# EasyEDA Pro project ProPrj_CAR BY HAO V1.3(no osd)_2026-07-17.epro, board PCB2
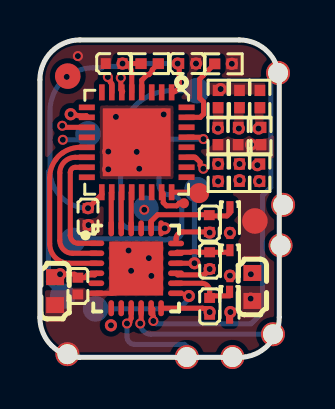
[diagram p4: board, top side]
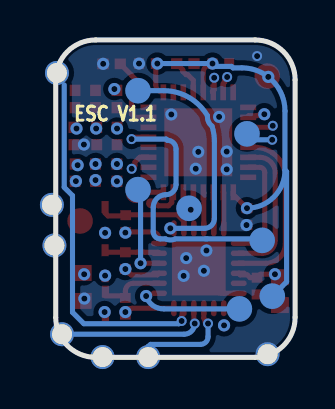
[diagram p5: board, bottom side, seen from below]

Outline 12 x 15.89 mm; copper layers: Top Layer, L2, L3, Bottom Layer. Coordinates in mm from the lower left corner of the outline.
Outline path: 0,13.89 0,2 arc(0.59,0.59) 2,0 10,0 arc(11.41,0.59) 12,2 12,13.89 arc(11.41,15.3) 10,15.89 2,15.89 arc(0.59,15.3) 0,13.89
Stack: Top Layer 0.035mm / Dielectric1 1.51mm FR4 er 4.5 / L2 0.035mm / Dielectric2 0.48mm PP er 4.5 / L3 0.035mm / Dielectric3 0.48mm PP er 4.5 / Bottom Layer 0.035mm

## Design rules (mm)
template: Custom Config
spacing copperThickness1oz (default): track to track 0.152, other pairs 0 to 0.3
spacing copperThickness2oz: track to track 0.203, other pairs 0.152 to 0.3
track width copperThickness1oz (default): min 0.127, default 0.254, max 2.54
track width copperThickness2oz: min 0.203, default 0.254, max 2.54
differential pair differentialPair (default): width min 0.127, default 0.254, max 2.54; gap min 0.152, default 0.152
via viaSize (default): diameter min 0.5, default 0.61, max 10; hole min 0.3, default 0.305, max 6.3
net GND uses phu 100
pour e0 uses phu 100

## Placement (name value [footprint] x y rotation side)
C1  -  [C0603]  0.76 3.32 270 top
C1#2  -  [C0603]  10.65 3.52 270 top
C2  -  [C0402]  1.91 3.57 270 top
C3  1uF  [C0402]  8.49 6.7 270 top
C4  1uF  [C0402]  8.51 4.84 270 top
C5  1uF  [C0402]  8.51 2.55 90 top
C7  100nF  [C0402]  7.41 14.71 0 top
C94  100nF  [C0402]  3.72 14.71 180 top
C123  -  [C0402]  2.41 7.05 90 top
NOREF  -  [Pad_e1078]  7.87 13.35 0 top
NOREF#2  -  [Pad_e1076]  5.32 7.46 0 top
NOREF#3  -  [Pad_e1077]  7.87 8.4 0 top
NOREF#4  -  [Pad_e1071]  11.94 14.24 270 top
NOREF#5  -  [Pad_e1075]  7.98 8.22 0 top
NOREF#6  -  [Pad_e1080]  1.65 5.86 0 top
NOREF#7  -  [Pad_e1073]  12.19 7.63 270 top
NOREF#8  -  [Pad_e1082]  2.79 2.43 0 top
NOREF#9  -  [Pad_e1079]  1.14 3.06 0 top
NOREF#10  -  [Pad_e1069]  9.65 0.01 270 top
NOREF#11  -  [Pad_e10]  10.78 6.83 0 top
NOREF#12  -  [Pad_e1068]  7.37 0.01 270 top
NOREF#13  -  [Pad_e1074]  7.22 7.72 0 top
NOREF#14  -  [Pad_e1081]  2.41 11.19 0 top
NOREF#15  -  [Pad_e1070]  11.68 1.16 270 top
NOREF#16  -  [Pad_e12]  1.4 14.08 0 top
NOREF#17  -  [Pad_e1067]  1.38 0.16 270 top
NOREF#18  -  [Pad_e1072]  12.06 5.6 270 top
R7  10K  [R0402]  11.03 9.25 90 top
R8  10K  [R0402]  10 9.25 90 top
R9  10K  [R0402]  8.93 9.25 90 top
R10  1K  [R0402]  11.09 11.08 90 top
R11  1K  [R0402]  9.94 11.08 90 top
R12  1K  [R0402]  8.93 11.08 90 top
R13  -  [R0402]  5.5 14.7 0 top
R14  -  [R0402]  9.2 14.69 0 top
R54  10K  [R0402]  10 12.93 90 top
R55  10K  [R0402]  8.93 12.93 90 top
R56  10K  [R0402]  11.03 12.93 90 top
U1  FD6288Q  [QFN-24_L4.0-W4.0-P0.50-BL-EP2.7]  4.83 4.46 270 top
U56  AT32F421K8U7  [QFN-32_L5.0-W5.0-P0.50-BL-EP3.4]  4.85 10.77 180 top
U64  1N5819WT  [SOD-523_L1.2-W0.8-LS1.6-RD]  9.53 6.87 270 top
U65  1N5819WT  [SOD-523_L1.2-W0.8-LS1.6-RD]  9.53 4.71 270 top
U66  1N5819WT  [SOD-523_L1.2-W0.8-LS1.6-RD]  9.51 2.64 270 top

## Footprints (pads in the part's own frame, mm; a bottom-side part is the same pattern mirrored in y, then rotated)
C0402
  rect 0.5x0.54 smd: 1(-0.42,0) 2(0.42,0)
C0603
  rect 0.8x0.9 smd: 1(-0.7,0) 2(0.7,0)
Pad_e10
  round 1.282 smd: 1(0,0)
Pad_e12
  round 1.282 smd: 1(0,0)
Pad_e1067
  oval 1.2x1.2 hole 1: 1(0,0)
Pad_e1068
  oval 1.2x1.2 hole 1: 1(0,0)
Pad_e1069
  oval 1.2x1.2 hole 1: 1(0,0)
Pad_e1070
  oval 1.2x1.2 hole 1: 1(0,0)
Pad_e1071
  oval 1.2x1.2 hole 1: 1(0,0)
Pad_e1072
  oval 1.2x1.2 hole 1: 1(0,0)
Pad_e1073
  oval 1.2x1.2 hole 1: 1(0,0)
Pad_e1074
  round 0.5 smd: 1(0,0)
Pad_e1075
  round 1 smd: 1(0,0)
Pad_e1076
  round 1.282 smd far side: 1(0,0)
Pad_e1077
  round 1.282 smd far side: 1(0,0)
Pad_e1078
  round 1.282 smd far side: 1(0,0)
Pad_e1079
  round 1.282 smd far side: 1(0,0)
Pad_e1080
  round 1.282 smd far side: 1(0,0)
Pad_e1081
  round 1.282 smd far side: 1(0,0)
Pad_e1082
  round 1.282 smd far side: 1(0,0)
QFN-24_L4.0-W4.0-P0.50-BL-EP2.7
  oval 0.28x0.8 smd: 1(-1.25,-2) 2(-0.75,-2) 3(-0.25,-2) 4(0.25,-2) 5(0.75,-2) 6(1.25,-2) 13(1.25,2) 14(0.75,2) 15(0.25,2) 16(-0.25,2) 17(-0.75,2) 18(-1.242,2)
  oval 0.8x0.28 smd: 7(2,-1.25) 8(2,-0.75) 9(2,-0.25) 10(2,0.25) 11(2,0.75) 12(2,1.25) 19(-2,1.25) 20(-2,0.75) 21(-2,0.25) 22(-2,-0.25) 23(-2,-0.75) 24(-2,-1.25)
  rect 2.7x2.7 smd: 25(0.013,0)
QFN-32_L5.0-W5.0-P0.50-BL-EP3.4
  rect 0.28x0.8 smd: 1(-1.75,-2.5) 2(-1.252,-2.5) 3(-0.751,-2.5) 4(-0.252,-2.5) 5(0.248,-2.5) 6(0.749,-2.5) 7(1.248,-2.5) 8(1.748,-2.5) 17(1.752,2.5) 18(1.252,2.5) 19(0.751,2.5) 20(0.252,2.5) 21(-0.248,2.5) 22(-0.749,2.5) 23(-1.248,2.5) 24(-1.748,2.5)
  rect 0.8x0.28 smd: 9(2.5,-1.748) 10(2.5,-1.248) 11(2.5,-0.748) 12(2.5,-0.248) 13(2.5,0.252) 14(2.5,0.752) 15(2.5,1.252) 16(2.5,1.752) 25(-2.5,1.75) 26(-2.5,1.25) 27(-2.5,0.75) 28(-2.5,0.25) 29(-2.5,-0.25) 30(-2.5,-0.75) 31(-2.5,-1.25) 32(-2.5,-1.75)
  rect 3.4x3.4 smd: 33(0,0)
R0402
  rect 0.566x0.54 smd: 1(-0.433,0) 2(0.433,0)
SOD-523_L1.2-W0.8-LS1.6-RD
  rect 0.6x0.36 smd: 1(-0.65,0) 2(0.65,0)

## Nets
3.3V-MCU: C7.1 C94.1 C123.2 NOREF#9.1 NOREF#16.1 R13.1 U56.1 U56.5 U56.17
10V: C1.1 C1#2.1 C2.1 NOREF#2.1 U1.4 U64.2 U65.2 U66.2
GND: C1.2 C1#2.2 C2.2 C7.2 C94.2 C123.1 NOREF#11.1 NOREF#17.1 R10.1 R11.1 R12.1 R14.2 U1.6 U1.25 U56.33
HIN1: U1.22 U56.20
HIN2: U1.23 U56.19
HIN3: U1.24 U56.18
HO1: NOREF.1 U1.19
HO2: NOREF#3.1 U1.16
HO3: NOREF#8.1 U1.13
LIN1: U1.1 U56.15
LIN2: U1.2 U56.14
LIN3: U1.3 U56.13
LO1: NOREF#4.1 U1.11
LO2: NOREF#15.1 U1.10
LO3: NOREF#12.1 U1.9
RX5(ESC): NOREF#6.1 U56.29
SIG1: R7.2 R10.2 R56.1 U56.6
SIG2: R8.2 R11.2 R54.1 U56.10
SIG3: R9.2 R12.2 R55.1 U56.11
SIG_ALL: R54.2 R55.2 R56.2 U56.7
SWCLK: NOREF#5.1 U56.24
SWDIO: NOREF#13.1 U56.23
VS1: C3.2 NOREF#7.1 R7.1 U1.18
VS2: C4.2 NOREF#18.1 R8.1 U1.15
VS3: C5.1 NOREF#10.1 R9.1 U1.12
$3N6163: C3.1 U1.20 U64.1
$3N6273: C4.1 U1.17 U65.1
$3N6320: C5.2 U1.14 U66.1
$3N31034: R13.2 U56.4
$3N31057: R14.1 U56.31
$3N32793: NOREF#14.1 U56.27

Pads without a net: U1 5 7 8 21; U56 2 3 8 9 12 16 21 22 25 26 28 30 32

## Via types
v1: diameter 0.61, hole 0.305, Top Layer to Bottom Layer, 42 vias
v2: diameter 0.5, hole 0.305, Top Layer to Bottom Layer, 11 vias

## Routing (per net, layer and track width the routed paths; a pad name or vN(x,y) marks a point on that pad's centre or on a via; arc(x,y) is an arc through that point)
3.3V-MCU: length 25.7
  Top Layer w0.254: U56.17 3.1,8.16 v1(2.41,7.47) ; C7.1 6.99,13.65 arc(6.87,13.38) U56.1 ; U56.5 4.6,14.25 arc(4.47,14.57) v1(4.14,14.71) 5.06,14.71 arc(5.07,14.71) R13.1
  Bottom Layer w0.254: 0.51,9.37 0.51,12.33 arc(0.73,13.28) v1(1.34,14.04) arc(1.97,14.38) 2.67,14.49 3.12,14.49 3.19,14.56 4,14.56 v1(4.14,14.71) v1(6.91,14.71) ; 0.51,9.37 0.43,9.29 0.43,3.78 NOREF#9.1 ; 0.51,9.37 arc(1.07,8.03) v1(2.41,7.47)
10V: length 20.2
  Top Layer w0.254: 0.63,4.12 0.68,4.16 v1(1.01,4.16) 1.74,4.16 C2.1 2.25,3.99 2.39,4.13 2.75,4.13 U1.4
  L2 w0.4: 9.53,6.18 v1(9.53,4.09) 9.55,4.07 v1(9.55,2.27) 8.56,1.28 6,1.28 5.94,1.22 5.41,1.22 5.28,1.09 4.12,1.09 3.6,1.6 v1(3.56,1.6)
  L3 w0.4: v2(5.23,7.39) 4.67,6.83 3.67,6.83 3.38,6.54 3.38,1.78 v1(3.56,1.6)
  vias: v1(9.53,6.23) v1(10.57,4.16)
GND: length 2.7
  Top Layer w0.254: U1.6 3.59,3.21 arc(4.46,3.57) U1.25
  vias: v1(2.44,6.62) v1(3.43,10.3) v1(3.43,9.41) v1(3.81,12.04) v1(4.44,5.35) v1(4.57,4.33) v1(4.85,10.29) v1(4.98,9.44) v1(5.46,4.97) v1(5.59,4.08) v1(6.21,12.16) v1(7.82,14.71) v1(9.62,14.69) v1(10.59,10.65) v1(10.56,2.94) v2(1.91,15.08)
HIN1: length 1.8
  Top Layer w0.254: U1.22 4.58,8.24 arc(4.58,8.26) U56.20
HIN2: length 1.8
  Top Layer w0.254: U1.23 4.08,8.24 arc(4.08,8.26) U56.19
HIN3: length 1.8
  Top Layer w0.254: U1.24 3.58,8.24 arc(3.58,8.26) U56.18
HO1: length 11.6
  Bottom Layer w0.254: v1(6.25,6.46) 4.54,6.46 arc(4.19,6.6) 4.05,6.95 4.05,10.81 arc(4.08,11.2) 4.16,11.57 arc(4.34,11.8) 4.39,12.09 arc(5.32,13.01) 6.59,13.35 NOREF.1
HO2: length 4.7
  Top Layer w0.254: U1.16 7.74,4.71 arc(7.75,4.71) v1(7.75,4.71)
  Bottom Layer w0.254: v1(7.75,4.71) 7.75,8.27 arc(7.78,8.36) NOREF#3.1
HO3: length 5
  Bottom Layer w0.254: NOREF#8.1 6.57,2.43 arc(7.13,2.6) v1(7.47,3.07)
LIN1: length 5.7
  Top Layer w0.254: U56.15 1.78,9.51 arc(1.6,9.44) 1.52,9.26 1.52,6.11 arc(1.64,5.83) 1.93,5.71 U1.1
LIN2: length 7.4
  Top Layer w0.254: U1.2 1.63,5.21 arc(1.18,5.39) 1,5.84 1,9.24 arc(1.23,9.79) 1.77,10.01 U56.14
LIN3: length 8.9
  Top Layer w0.254: U56.13 2.02,10.51 arc(1.56,10.44) 1.14,10.23 arc(0.95,10.09) 0.8,9.9 arc(0.57,9.47) 0.49,8.98 0.49,5.68 arc(0.78,4.99) 1.46,4.71 U1.3
LO1: length 18
  Top Layer w0.254: v2(5.69,1.82) 5.69,2.04 arc(5.66,2.12) 5.66,2.2 5.66,2.42 arc(5.62,2.45) U1.11
  Bottom Layer w0.254: 11.57,13.64 11.57,8.51 11.16,8.1 11.16,2.25 10.59,1.68 5.82,1.68 v2(5.69,1.82)
LO2: length 7.1
  Top Layer w0.254: U1.10 5.08,1.74 arc(5.06,1.71) v2(5.03,1.69)
  Bottom Layer w0.254: 11.05,1.16 5.57,1.16 arc(5.19,1.31) v2(5.03,1.69)
LO3: length 4.8
  Top Layer w0.254: U1.9 4.58,1.96 arc(4.53,1.86) 4.51,1.75 arc(4.44,1.71) v2(4.37,1.69)
  Bottom Layer w0.254: v2(4.37,1.69) 4.37,1.03 arc(4.48,0.76) 4.75,0.65 7.24,0.65 7.33,0.55 7.37,0.55
RX5(ESC): length 13.9
  Top Layer w0.254: v2(8.2,10.93) 8.11,11.02 U56.29
  Bottom Layer w0.254: v2(8.2,10.93) 6.47,10.93 6.41,10.87 arc(6.1,10.74) 5.97,10.43 5.97,8.65 arc(6.12,8.29) 6.48,8.14 arc(6.93,7.96) 7.11,7.51 7.11,6.29 arc(7.01,6.03) 6.76,5.93 6.5,5.93 arc(6.25,5.87) 6.01,5.93 4.49,5.93 arc(4.44,5.93) 4.4,5.93 1.83,5.93 arc(1.73,5.91) NOREF#6.1
SIG1: length 11.2
  Top Layer w0.254: v2(4.06,14) 4.06,13.4 4.15,13.31 arc(4.13,13.28) U56.6
  L3 w0.254: v1(10.96,11.45) 11.09,11.33 11.09,10.96 arc(11.17,10.65) 11.09,10.35 11.09,9.8 arc(11.01,9.69) v1(10.9,9.62) ; v2(4.06,14) 8.42,14 arc(8.62,13.99) 8.82,13.96 arc(9.24,13.99) 9.57,13.72 arc(10.58,12.79) 10.96,11.46
SIG2: length 12.3
  Top Layer w0.254: v1(1.54,12.17) 1.76,12.17 arc(1.85,12.11) 1.95,12.09 2.33,12.09 arc(2.35,12.06) U56.10
  L3 w0.254: v1(10,9.68) 10,10.6 arc(10,10.65) 10,10.7 10,11.42 arc(10,11.45) v1(9.97,11.45) arc(9.57,12.43) 8.59,12.84 2.22,12.84 arc(1.74,12.64) v1(1.54,12.17)
SIG3: length 10.8
  Top Layer w0.254: 2.23,11.51 1.2,11.51 v2(1.12,11.59) ; R12.2 8.93,11.52
  L3 w0.254: v1(8.93,9.68) 8.93,11.45 arc(8.93,11.45) v1(8.93,11.45) 1.62,11.45 arc(1.38,11.57) v2(1.12,11.59)
SIG_ALL: length 6.8
  Top Layer w0.254: U56.7 3.6,13.7 3.53,13.78 3.53,13.91 v2(3.41,14.04)
  L3 w0.254: v1(9.06,13.43) 4.01,13.43 arc(3.58,13.61) v2(3.41,14.04)
SWCLK: length 1.5
  Top Layer w0.254: U56.24 7.98,8.27 7.98,8.35
SWDIO: length 1.7
  Top Layer w0.254: NOREF#13.1 6.99,7.72 6.86,7.59 6.35,7.59 6.18,7.75 6.18,8.18 U56.23
VS1: length 7.5
  Top Layer w0.254: C3.2 7.17,6.28 arc(6.93,6.18) 6.83,5.94 U1.18
  L2 w0.254: 11.54,7.59 9.85,7.59 arc(8.9,7.19) v1(8.51,6.24)
  L3 w0.254: v1(10.99,8.82) 10.99,8.02 arc(11.1,7.75) 11.37,7.63 11.56,7.63
VS2: length 9.7
  Top Layer w0.254: U1.15 6.91,4.13 8.22,4.13 8.3,4.21 arc(8.45,4.27) v1(8.51,4.42)
  L3 w0.254: 11.41,5.56 11.41,6.06 arc(11.3,6.33) 11.03,6.45 arc(10.31,6.75) 10,7.47 v1(10,8.87) ; 11.41,5.56 9.65,5.56 arc(8.84,5.22) v1(8.51,4.42) ; 11.41,5.56 arc(11.46,5.59) 11.52,5.6 11.57,5.6
VS3: length 15.7
  Top Layer w0.254: v1(8.51,2.27) 8.33,2.45 8.24,2.45 arc(8.19,2.45) 8.15,2.46 U1.12
  L3 w0.254: v1(8.51,2.27) 9.59,1.18 9.59,0.55 8.22,0.55 6.88,1.89 6.88,6.76 v1(8.93,8.81)
$3N6163: length 4.8
  Top Layer w0.254: U64.1 9.53,7.22 9.38,7.08 8.53,7.08 C3.1 8.47,7.14 5.9,7.14 5.57,6.81 5.57,6.46 U1.20
$3N6273: length 2.8
  Top Layer w0.254: U65.1 arc(9.49,5.29) 9.42,5.26 C4.1 7.95,5.26 arc(7.75,5.3) 7.55,5.26 6.88,5.26 arc(6.84,5.25) U1.17
$3N6320: length 3.3
  Top Layer w0.254: U1.14 8.12,3.71 arc(8.39,3.59) 8.51,3.32 C5.2 arc(8.54,3.05) 8.61,3.08 9.53,3.08
$3N31034: length 1.8
  Top Layer w0.254: R13.2 5.63,14.4 5.63,14.32 5.47,14.15 5.39,14.15 5.1,13.87 U56.4
$3N31057: length 3.8
  Top Layer w0.254: R14.1 8.21,14.14 8.21,14.12 8.01,13.93 8.01,12.98 8.21,12.78 8.21,12.18 8.04,12.02 U56.31
$3N32793: length 10.2
  Top Layer w0.254: v2(8.19,9.44) 8.03,9.6 8.03,9.77 7.87,9.93 7.87,9.93 7.78,10.02 U56.27
  L3 w0.254: v2(1.15,10.89) 6.74,10.89 v2(8.19,9.44)
  Bottom Layer w0.254: NOREF#14.1 2.11,10.89 v2(1.15,10.89)

## Copper pours and planes (outline as drawn; the poured copper is in the pictures)
10V on L2: 9.13,6.57 10,6.57 10,1.75 9.13,1.75
10V on L2: 9.87,6.57 11.3,6.57 11.3,3.4 9.87,3.4
10V on L3: 0.68,4.62 0.68,3.77 2.02,2.43 3.29,2.43 3.29,5.67 3.38,5.77 1.98,5.77 1.93,5.71 1.77,5.71
GND on Top Layer: -0.65,16.35 12.94,16.35 12.94,-0.67 -0.65,-0.67
GND on Top Layer: 8.66,10.9 11.23,10.9 11.23,10.4 8.66,10.4
GND on Bottom Layer: -0.4,16.1 12.68,16.1 12.68,-0.79 -0.4,-0.79
GND on L2: -0.53,16.22 12.94,16.22 12.94,-0.92 -0.53,-0.92
GND on L3: -0.27,16.22 12.94,16.22 12.94,-0.67 -0.27,-0.67
SIG_ALL on Top Layer: 8.43,13.75 11.27,13.75 11.27,13.16 8.43,13.16

Small or netless copper shapes (teardrops, artwork), in the pictures only: 3 on Top Layer

## Text on the board
Bottom Silkscreen Layer: ESC V1.1
